# Altium schematic sheet Power system 1.SchDoc: Power system 1
size A3; Author: Vi Tín; SheetNumber: 3; SheetTotal: 16
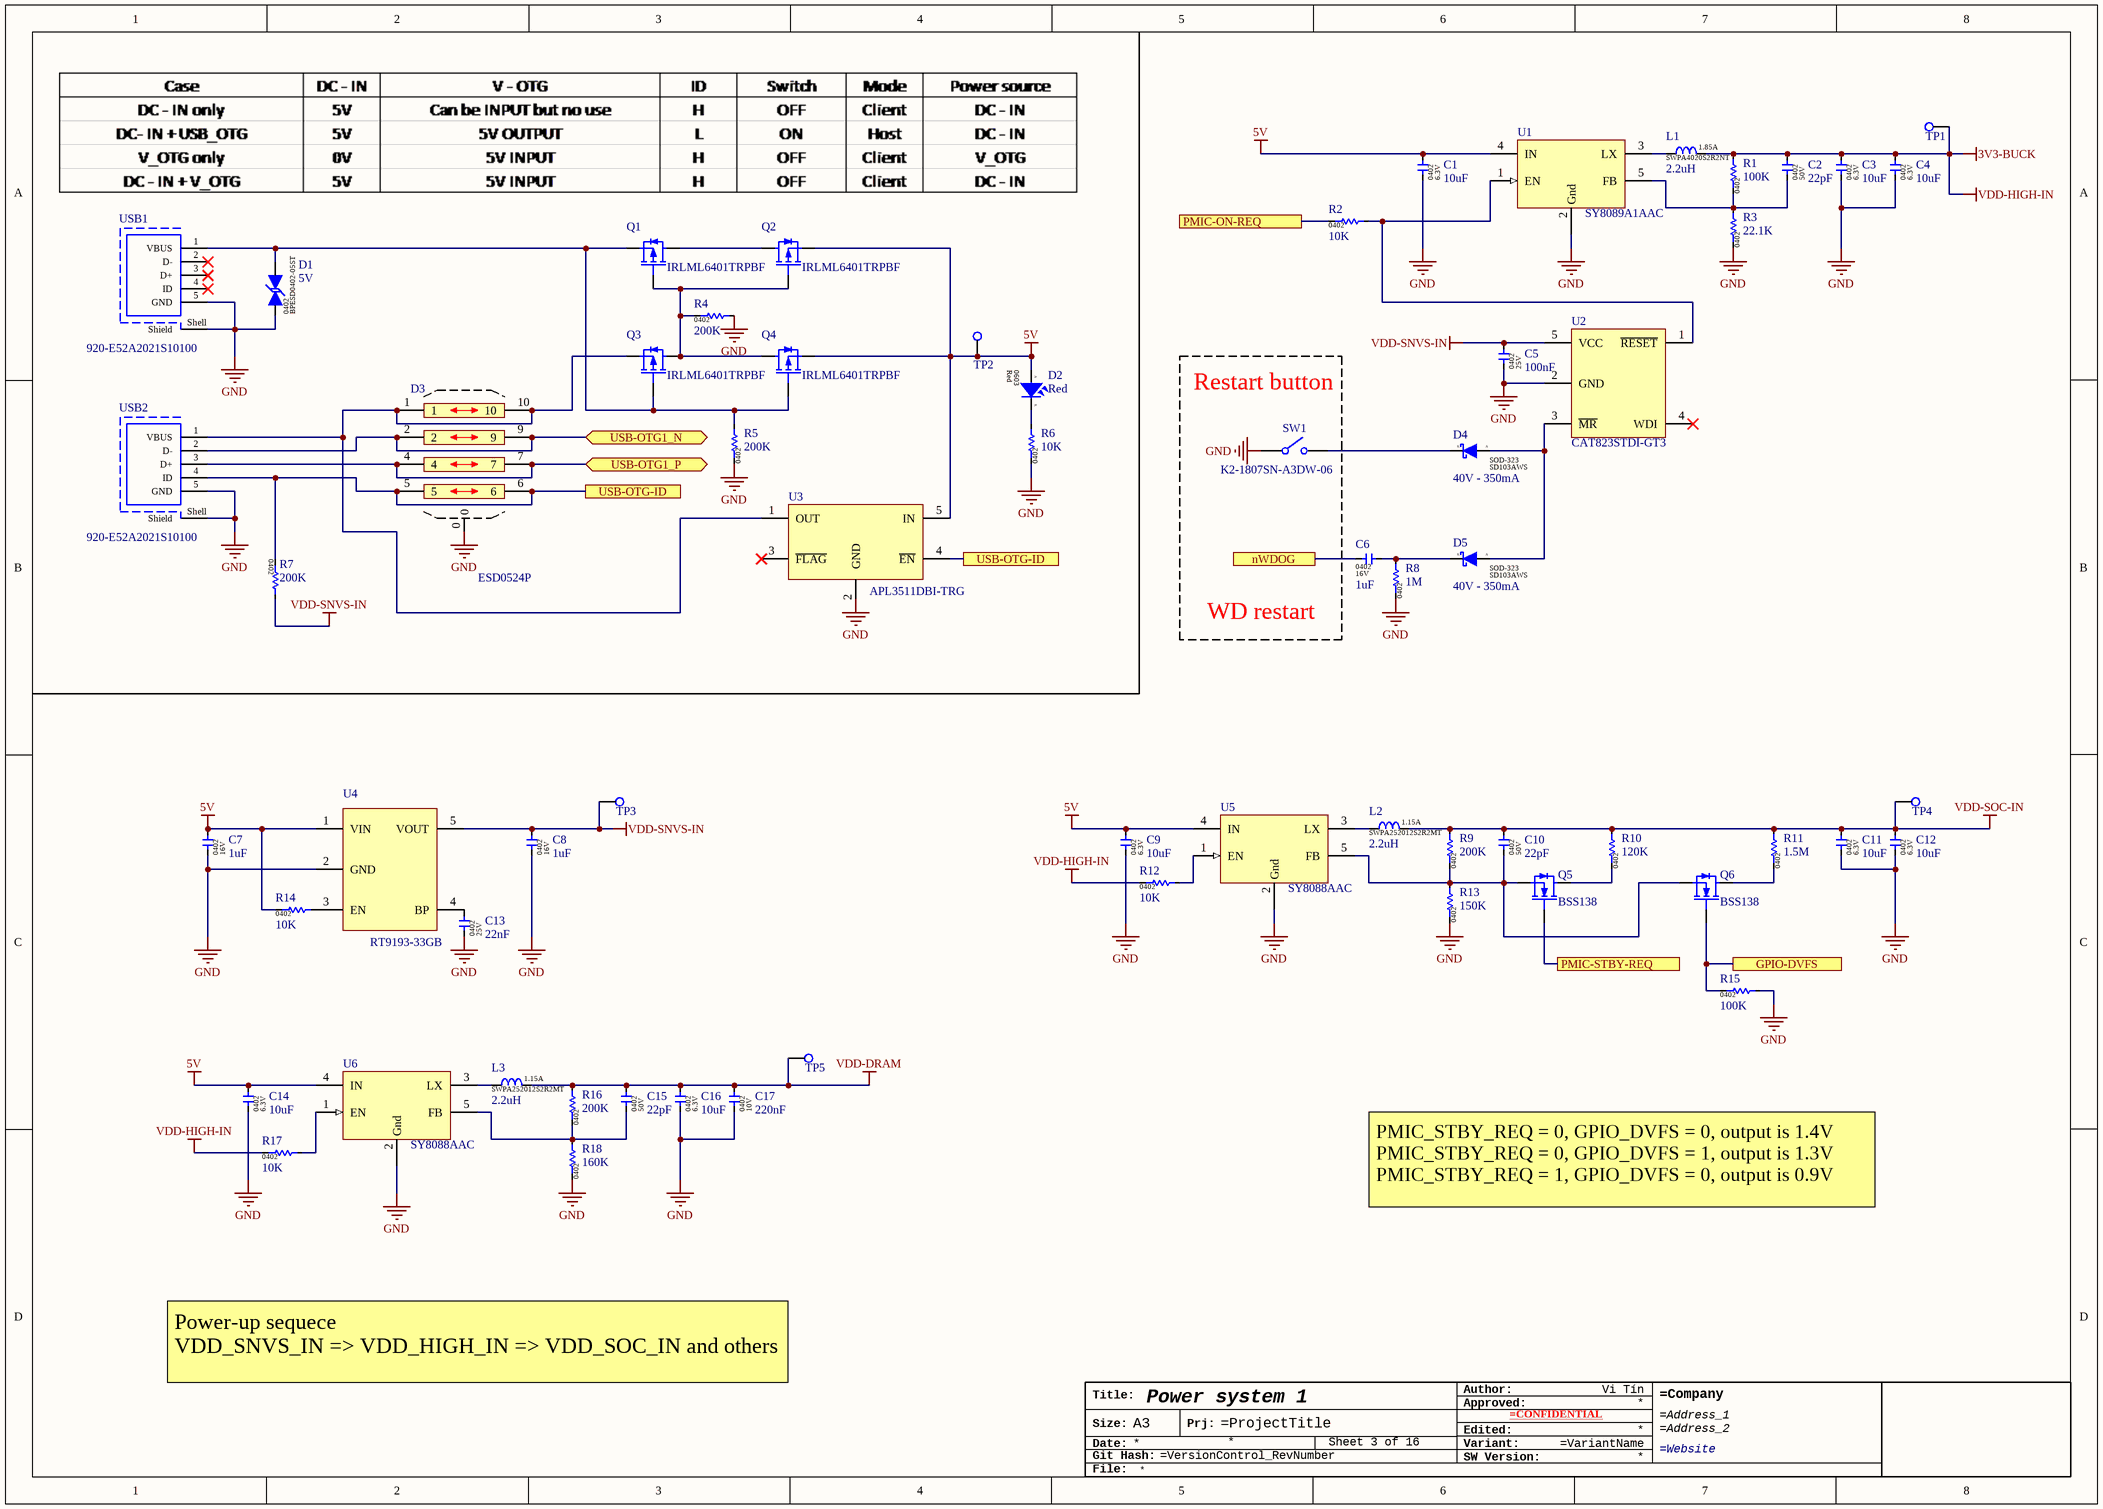
[diagram p0: Power system 1.SchDoc]

## Parts
*?  TitleBlock_Generic  (value not drawn)  (graphical)
C1  10uF  [CAP-0402]
C2  22pF  [CAP-0402]
C3  10uF  [CAP-0402]
C4  10uF  [CAP-0402]
C5  100nF  [CAP-0402]
C6  1uF  [CAP-0402]
C7  1uF  [CAP-0402]
C8  1uF  [CAP-0402]
C9  10uF  [CAP-0402]
C10  22pF  [CAP-0402]
C11  10uF  [CAP-0402]
C12  10uF  [CAP-0402]
C13  22nF  [CAP-0402]
C14  10uF  [CAP-0402]
C15  22pF  [CAP-0402]
C16  10uF  [CAP-0402]
C17  220nF  [CAP-0402]
D1  5V  [Diode-0402]
D2  Red  [LED-0603 RED]
D3  ESD0524P  [DFN2510]
D4  40V - 350mA  [SOD323 (UNI)]
D5  40V - 350mA  [SOD323 (UNI)]
L1  2.2uH  [IND-4020]
L2  2.2uH  [IND-252012]
L3  2.2uH  [IND-252012]
Q1  IRLML6401TRPBF  [SOT23-3]
Q2  IRLML6401TRPBF  [SOT23-3]
Q3  IRLML6401TRPBF  [SOT23-3]
Q4  IRLML6401TRPBF  [SOT23-3]
Q5  BSS138  [SOT23-3]
Q6  BSS138  [SOT23-3]
R1  100K  [RES-0402]
R2  10K  [RES-0402]
R3  22.1K  [RES-0402]
R4  200K  [RES-0402]
R5  200K  [RES-0402]
R6  10K  [RES-0402]
R7  200K  [RES-0402]
R8  1M  [RES-0402]
R9  200K  [RES-0402]
R10  120K  [RES-0402]
R11  1.5M  [RES-0402]
R12  10K  [RES-0402]
R13  150K  [RES-0402]
R14  10K  [RES-0402]
R15  100K  [RES-0402]
R16  200K  [RES-0402]
R17  10K  [RES-0402]
R18  160K  [RES-0402]
SW1  K2-1807SN-A3DW-06  [SW - TYPE 3]
TP1  N/A  [Test point]  (value not drawn)  (no BOM)
TP2  N/A  [Test point]  (value not drawn)  (no BOM)
TP3  N/A  [Test point]  (value not drawn)  (no BOM)
TP4  N/A  [Test point]  (value not drawn)  (no BOM)
TP5  N/A  [Test point]  (value not drawn)  (no BOM)
U1  SY8089A1AAC  [SOT23-5]
U2  CAT823STDI-GT3  [SOT23-5]
U3  APL3511DBI-TRG  [SOT23-5]
U4  RT9193-33GB  [SOT23-5]
U5  SY8088AAC  [SOT23-5]
U6  SY8088AAC  [SOT23-5]
USB1  920-E52A2021S10100  [Micro USB - type 2]
USB2  920-E52A2021S10100  [Micro USB - type 2]

## Ports
GPIO-DVFS, nWDOG, PMIC-ON-REQ, PMIC-STBY-REQ, USB-OTG1_N (bidir), USB-OTG1_P (bidir), USB-OTG-ID

## Nets
3V3-BUCK: C2.2 C3.2 C4.2 L1.2 R1.2 R12.1 R17.1 TP1.1  [also labelled VDD-HIGH-IN]
5V: C1.2 C7.2 C9.2 C14.2 D2.2(Anode) Q2.2(S) Q4.2(S) R14.1 TP2.1 U1.4(IN) U3.5(IN) U4.1(VIN) U5.4(IN) U6.4(IN)
GND: C1.1 C3.1 C4.1 C5.1 C7.1 C8.1 C9.1 C11.1 C12.1 C13.1 C14.1 C16.1 C17.1 D1.1 D3.0 R3.1 R4.2 R5.1 R6.1 R8.1 R13.1 R15.2 R18.1 SW1.1 U1.2(Gnd) U2.2(GND) U3.2(GND) U4.2(GND) U5.2(Gnd) U6.2(Gnd) USB1.5(GND) USB1.Shell(Shield) USB2.5(GND) USB2.Shell(Shield)
VDD-DRAM: C15.2 C16.2 C17.2 L3.2 R16.2 TP5.1
VDD-SNVS-IN: C5.2 C8.2 R7.2 TP3.1 U2.5(VCC) U4.5(VOUT)
VDD-SOC-IN: C10.2 C11.2 C12.2 L2.2 R9.2 R10.2 R11.2 TP4.1
GPIO-DVFS: Q6.1(G) R15.1 ; port GPIO-DVFS
nWDOG: C6.1 ; port nWDOG
PMIC-ON-REQ: R2.1 ; port PMIC-ON-REQ
PMIC-STBY-REQ: Q5.1(G) ; port PMIC-STBY-REQ
USB-OTG1_N: D3.2 D3.9 USB2.2(D-) ; port USB-OTG1_N
USB-OTG1_P: D3.4 D3.7 USB2.3(D+) ; port USB-OTG1_P
USB-OTG-ID: D3.5 D3.6 R7.1 U3.4(~{EN}) USB2.4(ID) ; port USB-OTG-ID
NetC2_1: C2.1 R1.1 R3.2 U1.5(FB)
NetC6_2: C6.2 D5.1(Cathode) R8.2
NetC10_1: C10.1 Q5.2(S) Q6.2(S) R9.1 R13.2 U5.5(FB)
NetC13_2: C13.2 U4.4(BP)
NetC15_1: C15.1 R16.1 R18.2 U6.5(FB)
NetD1_2: D1.2 Q1.2(S) Q3.1(G) Q4.1(G) R5.2 USB1.1(VBUS)
NetD2_1: D2.1(Cathode) R6.2
NetD3_1: D3.1 D3.10 Q3.2(S) U3.1(OUT) USB2.1(VBUS)
NetD4_1: D4.1(Cathode) SW1.2
NetD4_2: D4.2(Anode) D5.2(Anode) U2.3(~{MR})
NetL1_1: L1.1 U1.3(LX)
NetL2_1: L2.1 U5.3(LX)
NetL3_1: L3.1 U6.3(LX)
NetQ1_1: Q1.1(G) Q2.1(G) Q3.3(D) Q4.3(D) R4.1
NetQ1_3: Q1.3(D) Q2.3(D)
NetQ5_3: Q5.3(D) R10.1
NetQ6_3: Q6.3(D) R11.1
NetR2_2: R2.2 U1.1(EN) U2.1(~{RESET})
NetR12_2: R12.2 U5.1(EN)
NetR14_2: R14.2 U4.3(EN)
NetR17_2: R17.2 U6.1(EN)

Not connected (* = marked no-connect by the designer): U2 4(WDI)*; U3 3(~{FLAG})*; USB1 2(D-)* 3(D+)* 4(ID)*

## Notes on the sheet
- Restart button
- WD restart
- PMIC_STBY_REQ = 0, GPIO_DVFS = 0, output is 1.4V
  PMIC_STBY_REQ = 0, GPIO_DVFS = 1, output is 1.3V
  PMIC_STBY_REQ = 1, GPIO_DVFS = 0, output is 0.9V
- Power-up sequece
  VDD_SNVS_IN => VDD_HIGH_IN => VDD_SOC_IN and others
- (in symbol 19-217/R6C-AL1M2VY/3T) A; K
- (in symbol SD103AWS) K; A
- (in symbol TitleBlock_Generic) Author:; Title:; Approved:; Size:; A3; Prj:; Edited:; Date:; Variant:; SW Version:; Git Hash:; File:

## Library data of the parts
C1 C3 C4 C9 C11 C12 C14 C16 = 0402X106M6R3CT: 10uF ±20% 6.3V X5R 0402 Multilayer Ceramic Capacitors MLCC - SMD/SMT RoHS; Manufacture: WALSIN; Package / Case: 0402; Component type: Capacitor; Manufacture part: 0402X106M6R3CT; Capacitor value: 10uF; Voltage: 6.3V; Package: 0402
C2 C10 C15 = 0402N220J500CT: 22pF ±5% 50V NP0 0402 Multilayer Ceramic Capacitors MLCC - SMD/SMT RoHS; Manufacture: WALSIN; Package / Case: 0402; Component type: Capacitor; Manufacture part: 0402N220J500CT; Capacitor value: 22pF; Voltage: 50V; Package: 0402
C5 = 0402X104K250CT: 100nF ±10% 25V X5R 0402 Multilayer Ceramic Capacitors MLCC - SMD/SMT RoHS; Manufacture: WALSIN; Package / Case: 0402; Component type: Capacitor; Manufacture part: 0402X104K250CT; Capacitor value: 100nF; Voltage: 25V; Package: 0402
C6-C8 = 0402X105K160CT: 1uF ±10% 16V X5R 0402 Multilayer Ceramic Capacitors MLCC - SMD/SMT RoHS; Manufacture: WALSIN; Package / Case: 0402; Component type: Capacitor; Manufacture part: 0402X105K160CT; Capacitor value: 1uF; Voltage: 16V; Package: 0402
C13 = 0402B223K250CT: 22nF ±10% 25V X7R 0402 Multilayer Ceramic Capacitors MLCC - SMD/SMT RoHS; Manufacture: WALSIN; Package / Case: 0402; Component type: Capacitor; Manufacture part: 0402B223K250CT; Capacitor value: 22nF; Voltage: 25V; Package: 0402
C17 = 0402X224J100CT: 220nF ±5% 10V X5R 0402 Multilayer Ceramic Capacitors MLCC - SMD/SMT RoHS; Manufacture: WALSIN; Package / Case: 0402; Component type: Capacitor; Manufacture part: 0402X224J100CT; Capacitor value: 220nF; Voltage: 10V; Package: 0402
D1 = BPESD0402-05ST: Bidirectional 40V 5V (Max) 0402 ESD Protection Devices ROHS; Manufacture: BORN; Manufacture part: BPESD0402-05ST; Type: TVS/ESD Bi diode; Diode value: 5V; Package: 0402; Datasheet: https://datasheet.lcsc.com/lcsc/1811031631_BORN-BPESD0402-05ST_C316059.pdf
D2 = 19-217/R6C-AL1M2VY/3T: Red 617.5~633.5nm 0603 Light Emitting Diodes (LED) RoHS; Manufacture: Everlight Elec; Package / Case: 0402; Component type: Led; Part reference: *; Manufacture part: 19-217/R6C-AL1M2VY/3T; Color: Red; Package: 0603
D3 = ESD0524P: DFN2510 ESD Protection Devices ROHS; Manufacture: MDD（Microdiode Electronics）; Type: TVS/ESD Bi diode; Diode value: 5V; Manufacture part: ESD0524P; Package: DFN2510; Datasheet: https://datasheet.lcsc.com/lcsc/2009281808_MDD-Microdiode-Electronics--ESD0524P_C840786.pdf
D4 D5 = SD103AWS: 40V 350mA 600mV @ 200mA SOD-323 Schottky Barrier Diodes (SBD) ROHS; Manufacture: Shikues; Manufacture part: SD103AWS; Type: Schottky diode; Diode value: 40V - 350mA; Package: SOD-323; Datasheet: https://datasheet.lcsc.com/lcsc/1809211226_Shikues-SD103AWS_C109204.pdf
L1 = SWPA4020S2R2NT: Inductor 40x40x20, 2.2±30%  , 1.85A; Manufacture: SUNLORD; DCR: 0.04 Ω; Manufacture part: SWPA4020S2R2NT; Inductance value: 2.2uH; Irms max: 1.85A; Package: 4020
L2 L3 = SWPA252012S2R2MT: Inductor 25x20x12,  2.2±20%, 1.15A; Manufacture: SUNLORD; DCR: 0.216 Ω; Manufacture part: SWPA252012S2R2MT; Inductance value: 2.2uH; Irms max: 1.15A; Package: 252012
Q1-Q4 = IRLML6401TRPBF: P-Channel 12V 4.3A 950mV @ 250uA 50mΩ @ 4.3A,4.5V 1.3W SOT-23(SOT-23-3) MOSFETs RoHS; Manufacture: Infineon Technologies; Type: P-Mosfet; Manufacture part: IRLML6401TRPBF; Package: SOT23-3; Datasheet: https://datasheet.lcsc.com/lcsc/International-Rectifier-IR-IRLML6401TRPBF_C3034.pdf
Q5 Q6 = BSS138: N-Channel 50V 220mA 1.5V @ 1mA 3.5Ω @ 220mA,10V 360mW SOT-23(SOT-23-3) MOSFETs RoHS; Manufacture: Shikues; Type: N-Mosfet; Manufacture part: BSS138; Package: SOT23-3; Datasheet: https://datasheet.lcsc.com/lcsc/1811101310_Shikues-BSS138_C112239.pdf
R1 R15 = WR04X1003FTL: 100kΩ ±1% 1/16W ±100ppm/℃ 0402 Chip Resistor - Surface Mount RoHS; Manufacture: WALSIN; Package / Case: 0201; Component type: Resistor; Manufacture part: WR04X1003FTL; Resistor value: 100K; Package: 0402
R2 R6 R12 R14 R17 = WR04X1002FTL: 10kΩ ±1% 1/16W ±100ppm/℃ 0402 Chip Resistor - Surface Mount RoHS; Manufacture: WALSIN; Package / Case: 0201; Component type: Resistor; Manufacture part: WR04X1002FTL; Resistor value: 10K; Package: 0402
R3 = WR04X2212FTL: 22.1kΩ ±1% 1/16W ±100ppm/℃ 0402 Chip Resistor - Surface Mount RoHS; Manufacture: WALSIN; Package / Case: 0201; Component type: Resistor; Manufacture part: WR04X2212FTL; Resistor value: 22.1K; Package: 0402
R4 R5 R7 R9 R16 = WR04X2003FTL: 200kΩ ±1% 1/16W ±100ppm/℃ 0402 Chip Resistor - Surface Mount RoHS; Manufacture: WALSIN; Package / Case: 0201; Component type: Resistor; Manufacture part: WR04X2003FTL; Resistor value: 200K; Package: 0402
R8 = WR04X1004FTL: 1MΩ ±1% 1/16W ±100ppm/℃ 0402 Chip Resistor - Surface Mount RoHS; Manufacture: WALSIN; Package / Case: 0201; Component type: Resistor; Manufacture part: WR04X1004FTL; Resistor value: 1M; Package: 0402
R10 = WR04X1203FTL: 120kΩ ±1% 1/16W ±100ppm/℃ 0402 Chip Resistor - Surface Mount RoHS; Manufacture: WALSIN; Package / Case: 0201; Component type: Resistor; Manufacture part: WR04X1203FTL; Resistor value: 120K; Package: 0402
R11 = WR04W1504FTL: 1.5MΩ ±1% 1/16W ±100ppm/℃ 0402 Chip Resistor - Surface Mount RoHS; Manufacture: WALSIN; Package / Case: 0201; Component type: Resistor; Manufacture part: WR04W1504FTL; Resistor value: 1.5M; Package: 0402
R13 = WR04X1503FTL: 150kΩ ±1% 1/16W ±100ppm/℃ 0402 Chip Resistor - Surface Mount RoHS; Manufacture: WALSIN; Package / Case: 0201; Component type: Resistor; Manufacture part: WR04X1503FTL; Resistor value: 150K; Package: 0402
R18 = WR04X1603FTL: 160kΩ ±1% 1/16W ±100ppm/℃ 0402 Chip Resistor - Surface Mount RoHS; Manufacture: WALSIN; Package / Case: 0201; Component type: Resistor; Manufacture part: WR04X1603FTL; Resistor value: 160K; Package: 0402
SW1 = K2-1807SN-A3DW-06: SMD,3×4×2.0mm Tactile Switches RoHS; Manufacture: Korean Hroparts Elec; Manufacture part: K2-1807SN-A3DW-06; Type: Tactile Switches; Datasheet: https://datasheet.lcsc.com/lcsc/2008221234_XUNPU-TS-1088-AR02016_C720477.pdf
TP1-TP5 = N/A: A point used for measure.; Manufacture part: N/A; Manufacture: N/A; Type: Test point
U1 = SY8089A1AAC: 5.5V 2A SOT-23-5 DC-DC Converters RoHS; Manufacture: Richtek Tech; Manufacture part: SY8089A1AAC; Type: Buck; Package: SOT23-5; Datasheet: https://datasheet.lcsc.com/lcsc/2001171834_Silergy-Corp-SY8089A1AAC_C479074.pdf
U2 = CAT823STDI-GT3: 2.93V Monitors & Reset Circuits with manual reset and watchdog; Manufacture: ON Semiconductor; Manufacture part: CAT823STDI-GT3; Package: SOT23-5; Datasheet: https://datasheet.lcsc.com/lcsc/ON-Semicon-ON-CAT823STDI-GT3_C91362.pdf
U3 = APL3511DBI-TRG: 5.5V, 1.5A Power Distribution Switches ROHS; Manufacture: Anpec Elec; Manufacture part: APL3511DBI-TRG; Package: SOT23-5; Datasheet: https://datasheet.lcsc.com/lcsc/1912111437_Anpec-Elec-APL3511DBI-TRG_C351148.pdf
U4 = RT9193-33GB: Fixed 5.5V 3.3V 300mV @ 300mA SOT-23-5 Dropout Regulators(LDO) RoHS; Manufacture: Richtek Tech; Manufacture part: RT9193-33GB; Type: LDO; Package: SOT23-5; Datasheet: https://datasheet.lcsc.com/lcsc/Richtek-Tech-RT9193-28GB_C56731.pdf
U5 U6 = SY8088AAC: 5.5V 1A SOT-23-5 DC-DC Converters RoHS; Manufacture: Richtek Tech; Manufacture part: SY8088AAC; Type: Buck; Package: SOT23-5; Datasheet: https://datasheet.lcsc.com/lcsc/Silergy-Corp-SY8088AAC_C79313.pdf
USB1 USB2 = 920-E52A2021S10100: USB - Micro B Female USB 2 USB Connectors RoHS; Manufacture: Jing Extension of the Electronic Co.; Manufacture part: 920-E52A2021S10100; Type: USB-Micro B; Datasheet: https://datasheet.lcsc.com/lcsc/2103051832_Jing-Extension-of-the-Electronic-Co-920-E52A2021S10100_C10418.pdf
*? = TitleBlock_Generic: Manufacture part: TitleBlock_Generic; Manufacture: N/A; Type: Graphic